# EAGLE design rapidshark-dart-detector-mk-1.2 (EAGLE 6.5.0)
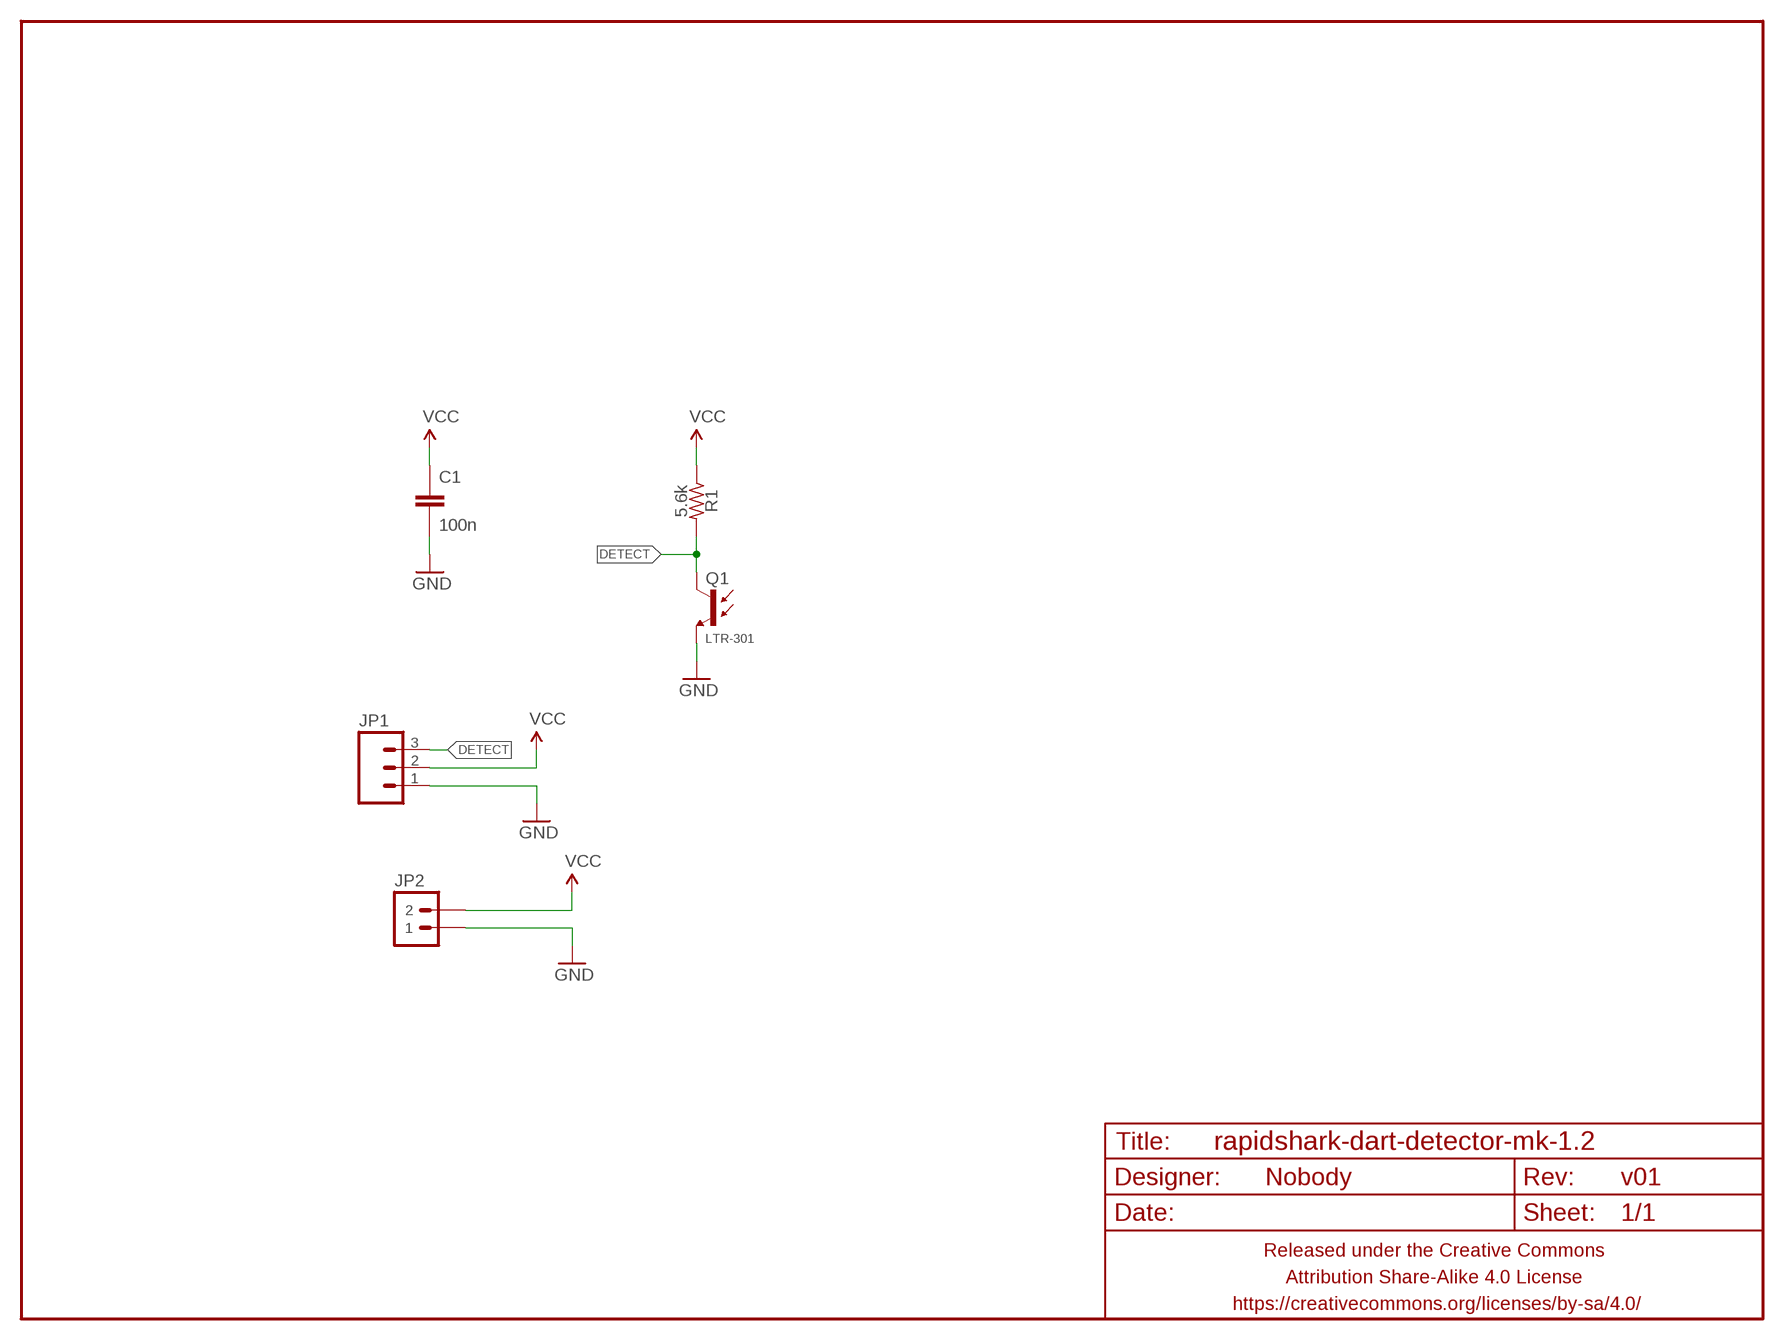
[diagram p0: schematic, sheet 1]

## Parts
C1  100n  CAPACITOR-CERAMIC025-024X044  [C025-024X044]
FRAME1  FRAME-LETTERNO_PACKAGE  [DUMMY]
JP1  M03JST-PTH  [JST-3-PH-RA-PTH]
JP2  M02JST-PTH-RA-R+  [JST-2-PH-RA-PTH-R+]
Q1  LTR-301  PHOTOTRANSISTOR2.54MM-SIDE  [LED-2.54MM-SIDE]
R1  5.6k  RESISTORPTH-AXIAL-5.08MM  [RESISTOR-AXIAL-PTH-5.08MM]

## Nets
DETECT: JP1.3 Q1.A(C) R1.P$2
GND: C1.2 JP1.1 JP2.1 Q1.K(E)
VCC: C1.1 JP1.2 JP2.2 R1.P$1

## Library data of the parts
C1 = A_butts:CAPACITOR-CERAMIC: CAPACITOR, European symbol
FRAME1 = A_butts:FRAME-LETTER: Schematic Frame Standard 8.5x11 US Letter frame; DESIGNER: Nobody; VERSION: v01
JP1 = A_butts:M03: Header 3 Standard 3-pin 0.1" header. Use with straight break away headers (SKU : PRT-00116), right angle break away headers (PRT-00553), swiss pins (PRT-00743), machine pins (PRT-00117), and female headers (PRT-00115). Molex polarized connector foot print use with SKU : PRT-08232 with associated crimp pins and housings.; SKU: PRT-09915
JP2 = A_butts:M02: Standard 2-pin 0.1" header. Use with - straight break away headers ( PRT-00116) - right angle break away headers (PRT-00553) - swiss pins (PRT-00743) - machine pins (PRT-00117) - female headers (PRT-00115) Molex polarized connector foot print use with: PRT-08233 with associated crimp pins and housings. 2.54_SCREWTERM for use with PRT-10571. 3.5mm Screw Terminal footprints for PRT-08084 5mm Screw Terminal footprints for use with PRT-08433
Q1 = A_butts:PHOTOTRANSISTOR
R1 = A_butts:RESISTOR: RESISTOR, American symbol

## Board
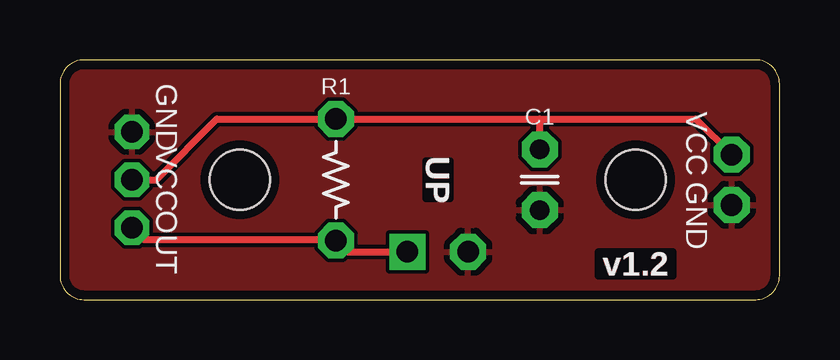
[diagram p1: board, top side]
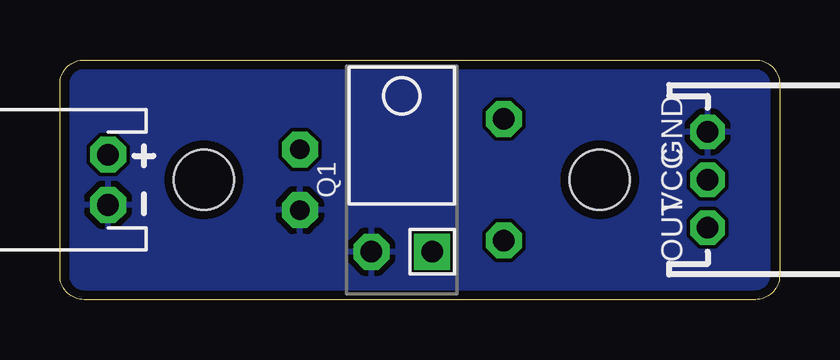
[diagram p2: board, bottom side, seen from below]

Size 30 x 10 mm. Coordinates in mm from the lower left corner, seen from the top.
Outline: 1,0 29,0 arc90 30,1 30,9 arc90 29,10 1,10 arc90 0,9 0,1 arc90 1,0
Copper layers (1*16): Top 0.0356mm / dielectric 1.5011mm / Bottom 0.0356mm
Design rules "LaenPCBOrder_2": minimum track width 6mil, minimum drill 13mil, track to track 6mil, track to pad 6mil, pad to pad 6mil, via to via 6mil, smd to smd 6mil, copper to edge 15mil, drill to drill 6mil, minimum pad ring 7mil, minimum via ring 7mil, stop-mask expansion 3mil, vias tented up to drill 20mil, thermal gap 10mil
Holes 2.5 mm at 24,5 7.5,5

### Footprints (pad centres in the part's own frame; a part is rotated, then mirrored left to right if it is on the bottom)
C025-024X044 = drill 0.813 pad 1.5 octagon: 1 -1.27,0; 2 1.27,0
JST-3-PH-RA-PTH = drill 0.9 pad 1.422 octagon: 1 -2,0; 2 0,0; 3 2,0
JST-2-PH-RA-PTH-R+ = drill 0.9 pad 1.5 octagon: 1 -1.05,0; 2 1.05,0
LED-2.54MM-SIDE = drill 0.9 pad 1.5 square: A 1.27,0 | drill 0.9 pad 1.5 octagon: K -1.27,0
RESISTOR-AXIAL-PTH-5.08MM = drill 0.9 pad 1.5 octagon: P$1 -2.54,0; P$2 2.54,0

### Placement (x,y rotation side)
C1  20,5 270 top
FRAME1  0,0 180 top
JP1  3,5 270 bottom
JP2  28,5 90 bottom
Q1  15.75,2 0 bottom
R1  11.5,5 270 top

### Tracks (layer width: path | path; a pad name or v marks a point on that pad's centre or on a via)
DETECT
  Top 0.3: Q1.A 11.96,2 R1.P$2 11.46,2.5 3.5,2.5 JP1.3
GND
  pour Bottom (rank 5): 1,10 29,10 arc-90 30,9 30,1 arc-90 29,0 1,0 arc-90 0,1 0,9 arc-90
  pour Top (rank 5): 1,10 29,10 arc-90 30,9 30,1 arc-90 29,0 1,0 arc-90 0,1 0,9 arc-90
VCC
  Top 0.3: JP1.2 4,5 6.54,7.54 R1.P$1 20,7.54 | 20,7.54 26.51,7.54 JP2.2 | C1.1 20,7.54

### Text on the board
Top: UP
tPlace: GND | VCC | VCC | UP | GND | OUT
bPlace: GND | VCC | OUT